# Altium schematic sheet СОГЛАСОВАНИЕ с мюксами.SchDoc
size 297 x 420 mm; Organization: Altium Limited; Address1: L3, 12a Rodborough Rd; Address2: Frenchs Forest; Address3: NSW; Address4: Australia 2086; SheetNumber: 3; SheetTotal: 5
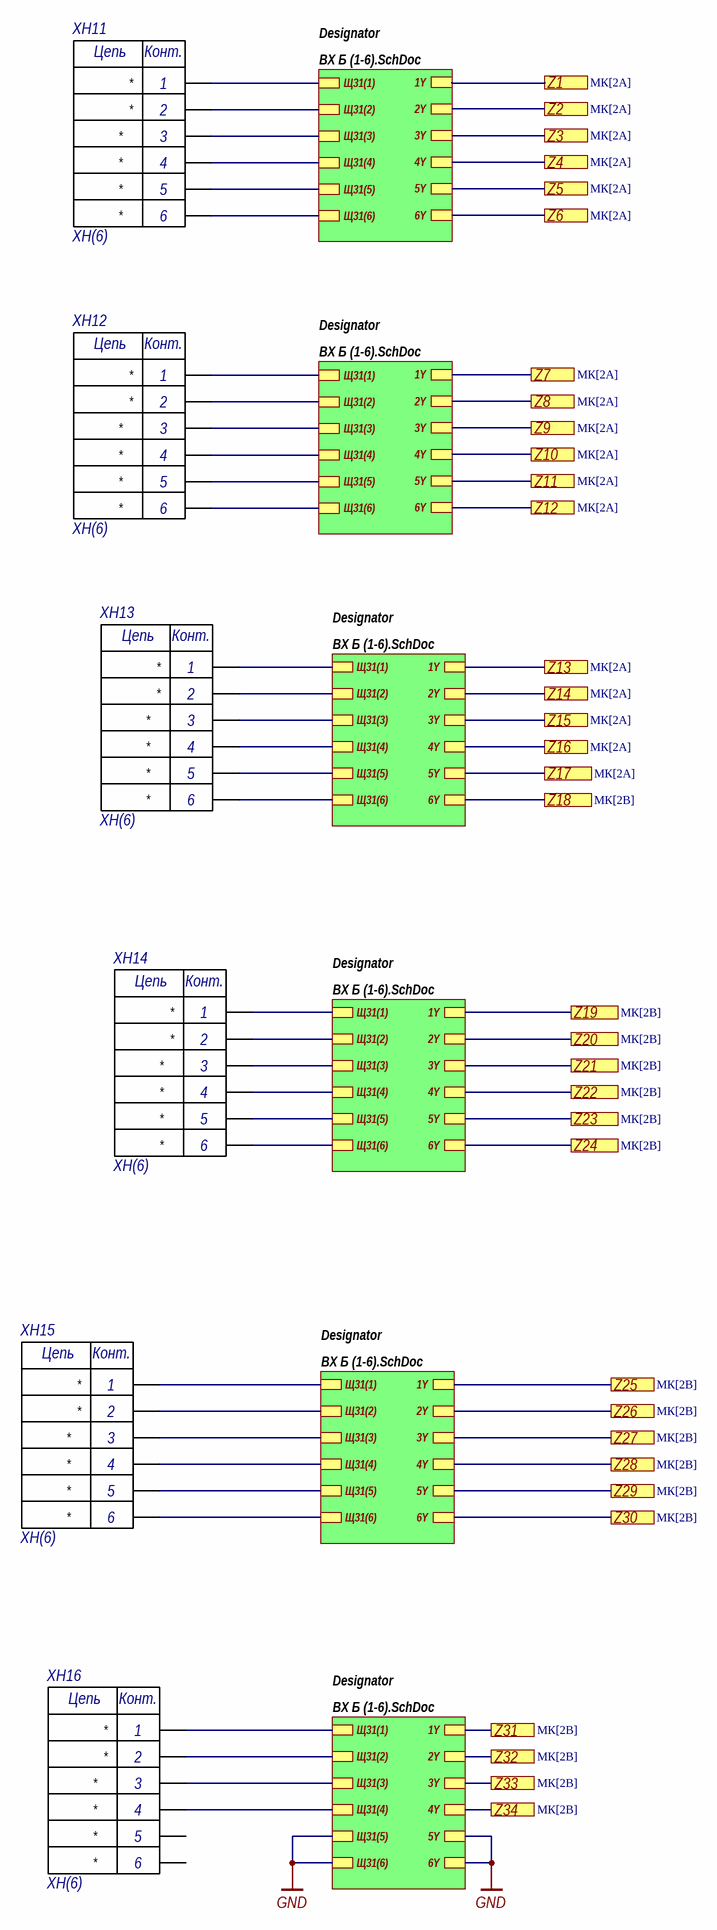
[diagram p0: СОГЛАСОВАНИЕ с мюксами.SchDoc]

## Parts
XH11  ХH(6)  [XH(6)]
XH12  ХH(6)  [XH(6)]
XH13  ХH(6)  [XH(6)]
XH14  ХH(6)  [XH(6)]
XH15  ХH(6)  [XH(6)]
XH16  ХH(6)  [XH(6)]

## Sub-sheets
Designator = ВХ Б (1-6).SchDoc: Щ31(1), Щ31(2), Щ31(3), Щ31(4), 2Y, 3Y, 4Y, 5Y, 6Y, Щ31(5), Щ31(6), 1Y
Designator = ВХ Б (1-6).SchDoc: Щ31(1), Щ31(2), Щ31(3), Щ31(4), 2Y, 3Y, 4Y, 5Y, 6Y, Щ31(5), Щ31(6), 1Y
Designator = ВХ Б (1-6).SchDoc: Щ31(1), Щ31(2), Щ31(3), Щ31(4), 2Y, 3Y, 4Y, 5Y, 6Y, Щ31(5), Щ31(6), 1Y
Designator = ВХ Б (1-6).SchDoc: Щ31(1), Щ31(2), Щ31(3), Щ31(4), 2Y, 3Y, 4Y, 5Y, 6Y, Щ31(5), Щ31(6), 1Y
Designator = ВХ Б (1-6).SchDoc: Щ31(1), Щ31(2), Щ31(3), Щ31(4), 2Y, 3Y, 4Y, 5Y, 6Y, Щ31(5), Щ31(6), 1Y
Designator = ВХ Б (1-6).SchDoc: Щ31(1), Щ31(2), Щ31(3), Щ31(4), 2Y, 3Y, 4Y, 5Y, 6Y, Щ31(5), Щ31(6), 1Y

## Ports
Z1 (see МК[2A]), Z2 (see МК[2A]), Z3 (see МК[2A]), Z4 (see МК[2A]), Z5 (see МК[2A]), Z6 (see МК[2A]), Z7 (see МК[2A]), Z8 (see МК[2A]), Z9 (see МК[2A]), Z10 (see МК[2A]), Z11 (see МК[2A]), Z12 (see МК[2A]), Z13 (see МК[2A]), Z14 (see МК[2A]), Z15 (see МК[2A]), Z16 (see МК[2A]), Z17 (see МК[2A]), Z18 (see МК[2B]), Z19 (see МК[2B]), Z20 (see МК[2B]), Z21 (see МК[2B]), Z22 (see МК[2B]), Z23 (see МК[2B]), Z24 (see МК[2B]), Z25 (see МК[2B]), Z26 (see МК[2B]), Z27 (see МК[2B]), Z28 (see МК[2B]), Z29 (see МК[2B]), Z30 (see МК[2B]), Z31 (see МК[2B]), Z32 (see МК[2B]), Z33 (see МК[2B]), Z34 (see МК[2B])

## Nets
GND: sheet Designator/5Y, sheet Designator/6Y, sheet Designator/Щ31(5), sheet Designator/Щ31(6)
Z1: port Z1, sheet Designator/1Y
Z2: port Z2, sheet Designator/2Y
Z3: port Z3, sheet Designator/3Y
Z4: port Z4, sheet Designator/4Y
Z5: port Z5, sheet Designator/5Y
Z6: port Z6, sheet Designator/6Y
Z7: port Z7, sheet Designator/1Y
Z8: port Z8, sheet Designator/2Y
Z9: port Z9, sheet Designator/3Y
Z10: port Z10, sheet Designator/4Y
Z11: port Z11, sheet Designator/5Y
Z12: port Z12, sheet Designator/6Y
Z13: port Z13, sheet Designator/1Y
Z14: port Z14, sheet Designator/2Y
Z15: port Z15, sheet Designator/3Y
Z16: port Z16, sheet Designator/4Y
Z17: port Z17, sheet Designator/5Y
Z18: port Z18, sheet Designator/6Y
Z19: port Z19, sheet Designator/1Y
Z20: port Z20, sheet Designator/2Y
Z21: port Z21, sheet Designator/3Y
Z22: port Z22, sheet Designator/4Y
Z23: port Z23, sheet Designator/5Y
Z24: port Z24, sheet Designator/6Y
Z25: port Z25, sheet Designator/1Y
Z26: port Z26, sheet Designator/2Y
Z27: port Z27, sheet Designator/3Y
Z28: port Z28, sheet Designator/4Y
Z29: port Z29, sheet Designator/5Y
Z30: port Z30, sheet Designator/6Y
Z31: port Z31, sheet Designator/1Y
Z32: port Z32, sheet Designator/2Y
Z33: port Z33, sheet Designator/3Y
Z34: port Z34, sheet Designator/4Y
NetXH11_1: XH11.1 ; sheet Designator/Щ31(1)
NetXH11_2: XH11.2 ; sheet Designator/Щ31(2)
NetXH11_3: XH11.3 ; sheet Designator/Щ31(3)
NetXH11_4: XH11.4 ; sheet Designator/Щ31(4)
NetXH11_5: XH11.5 ; sheet Designator/Щ31(5)
NetXH11_6: XH11.6 ; sheet Designator/Щ31(6)
NetXH12_1: XH12.1 ; sheet Designator/Щ31(1)
NetXH12_2: XH12.2 ; sheet Designator/Щ31(2)
NetXH12_3: XH12.3 ; sheet Designator/Щ31(3)
NetXH12_4: XH12.4 ; sheet Designator/Щ31(4)
NetXH12_5: XH12.5 ; sheet Designator/Щ31(5)
NetXH12_6: XH12.6 ; sheet Designator/Щ31(6)
NetXH13_1: XH13.1 ; sheet Designator/Щ31(1)
NetXH13_2: XH13.2 ; sheet Designator/Щ31(2)
NetXH13_3: XH13.3 ; sheet Designator/Щ31(3)
NetXH13_4: XH13.4 ; sheet Designator/Щ31(4)
NetXH13_5: XH13.5 ; sheet Designator/Щ31(5)
NetXH13_6: XH13.6 ; sheet Designator/Щ31(6)
NetXH14_1: XH14.1 ; sheet Designator/Щ31(1)
NetXH14_2: XH14.2 ; sheet Designator/Щ31(2)
NetXH14_3: XH14.3 ; sheet Designator/Щ31(3)
NetXH14_4: XH14.4 ; sheet Designator/Щ31(4)
NetXH14_5: XH14.5 ; sheet Designator/Щ31(5)
NetXH14_6: XH14.6 ; sheet Designator/Щ31(6)
NetXH15_1: XH15.1 ; sheet Designator/Щ31(1)
NetXH15_2: XH15.2 ; sheet Designator/Щ31(2)
NetXH15_3: XH15.3 ; sheet Designator/Щ31(3)
NetXH15_4: XH15.4 ; sheet Designator/Щ31(4)
NetXH15_5: XH15.5 ; sheet Designator/Щ31(5)
NetXH15_6: XH15.6 ; sheet Designator/Щ31(6)
NetXH16_1: XH16.1 ; sheet Designator/Щ31(1)
NetXH16_2: XH16.2 ; sheet Designator/Щ31(2)
NetXH16_3: XH16.3 ; sheet Designator/Щ31(3)
NetXH16_4: XH16.4 ; sheet Designator/Щ31(4)

Not connected (* = marked no-connect by the designer): XH16 5(*) 6(*)

## Notes on the sheet
- Подп. дата
- Инв. № дубл.
- Взам. инв. №
- Подп. и дата
- Инв. № подл.
- Изм.
- Лист
- № докум.
- Подп.
- Дата
- ALTIUM GOSTBOM2.0 KEV
- Файл:
- Копировал
- Формат А3
- (in symbol ХH(6)) Цепь; Конт.